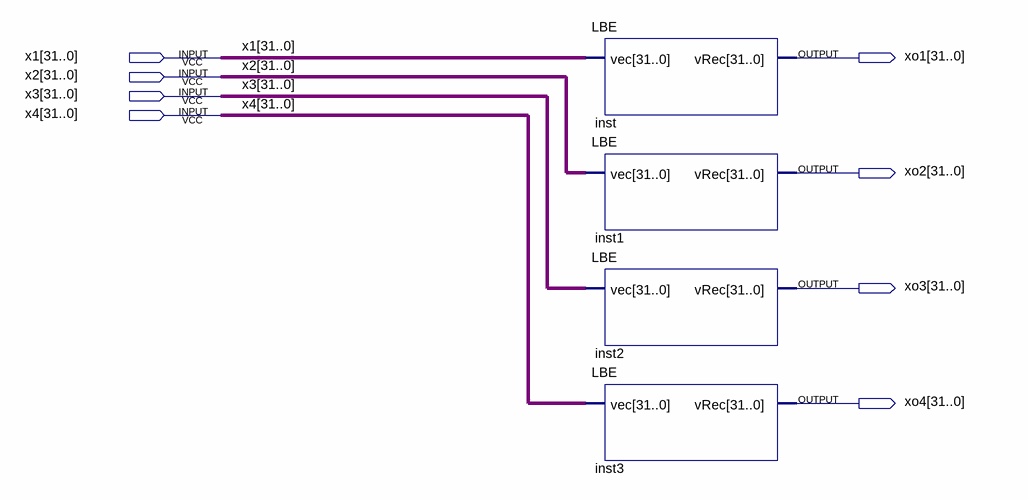
[diagram p0: schematic sheet]
// Quartus schematic LBE_block_2.bdf as structural Verilog: 4 symbols, 8 pins
module LBE_block_2 (
  input  [31:0] x1,
  input  [31:0] x2,
  input  [31:0] x3,
  input  [31:0] x4,
  output [31:0] xo1,
  output [31:0] xo2,
  output [31:0] xo3,
  output [31:0] xo4
);

  LBE inst (.vec(x1), .vRec(xo1));
  LBE inst1 (.vec(x2), .vRec(xo2));
  LBE inst2 (.vec(x3), .vRec(xo3));
  LBE inst3 (.vec(x4), .vRec(xo4));
endmodule
